# Altium schematic sheet LIM+LEDS+POWER.SchDoc: Laser PCB
size A3; DrawnBy: James Singleton; Organization: TMC Technology Ltd.; DocumentNumber: 5; Revision: A; SheetNumber: 5; SheetTotal: 18; Drawn Date: 22/12/2020
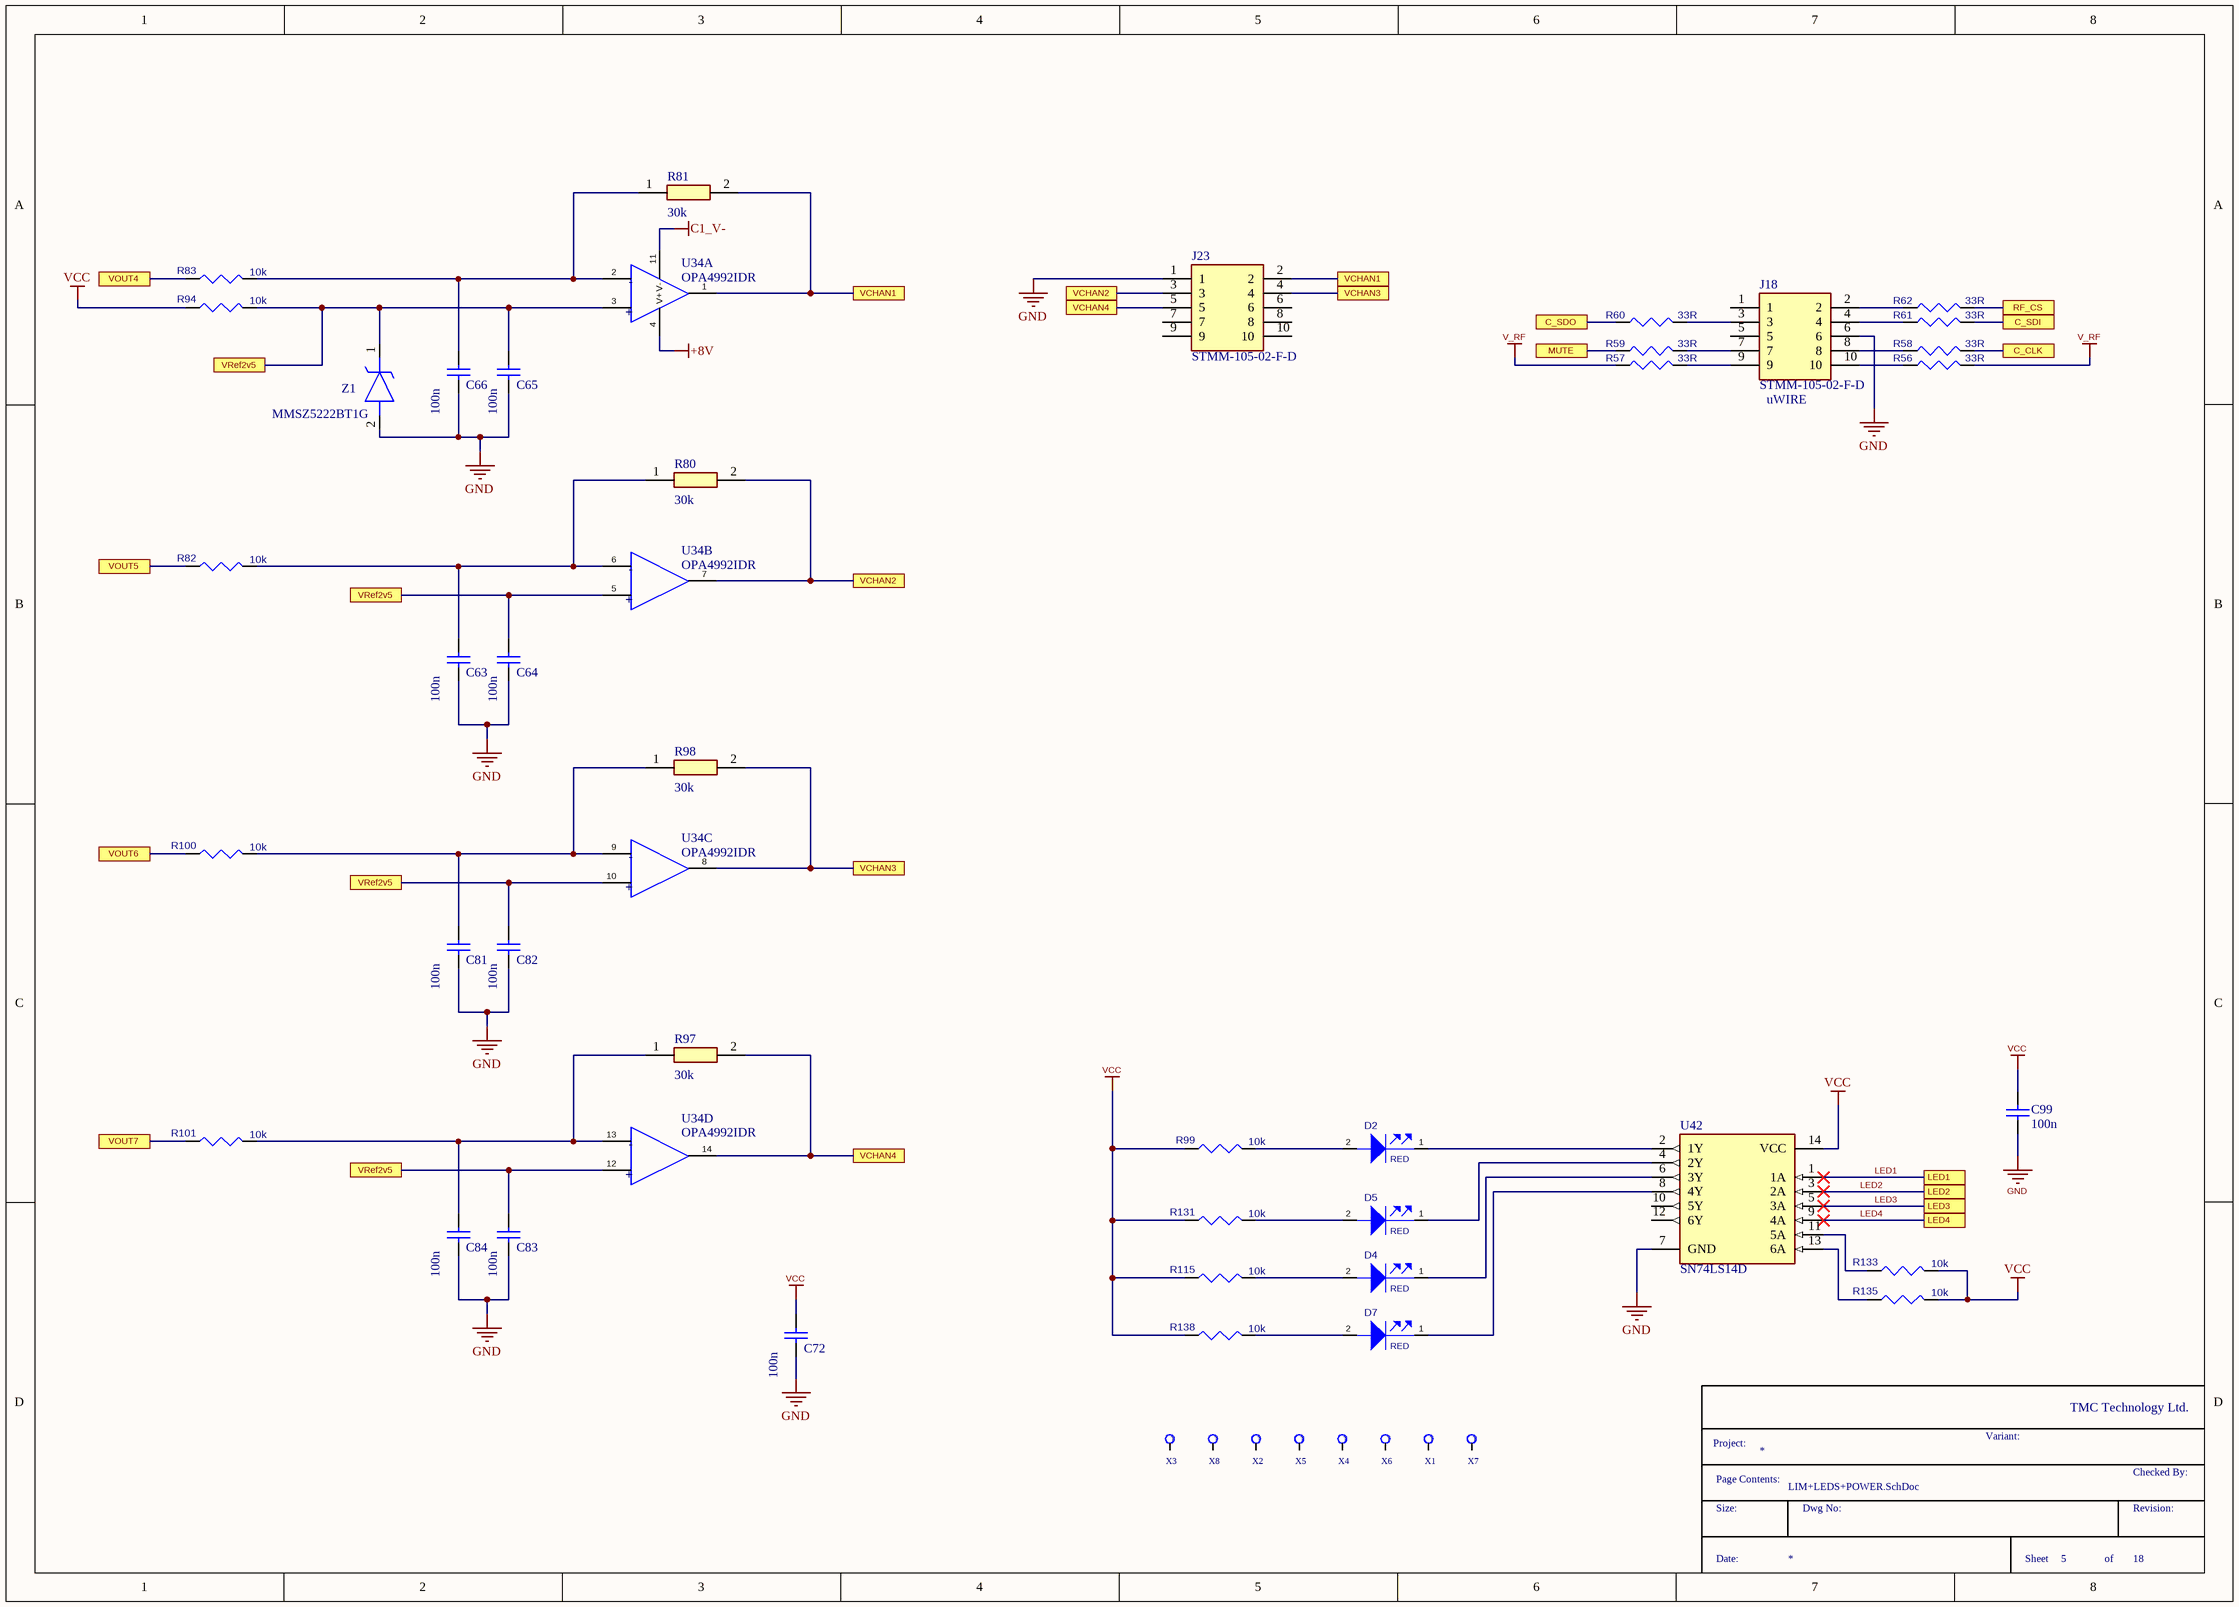
[diagram p0: LIM+LEDS+POWER.SchDoc]

## Parts
C63  100n  [CAPC1608X90X35LL15T15]
C64  100n  [CAPC1608X90X35LL15T15]
C65  100n  [CAPC1608X90X35LL15T15]
C66  100n  [CAPC1608X90X35LL15T15]
C72  100n  [CAPC1608X90X35LL15T15]
C81  100n  [CAPC1608X90X35LL15T15]
C82  100n  [CAPC1608X90X35LL15T15]
C83  100n  [CAPC1608X90X35LL15T15]
C84  100n  [CAPC1608X90X35LL15T15]
C99  100n  [CAPC1608X90X35LL15T15]
D2  value RED  [LED$2F$RA]  (hidden comment: LED)
D4  value RED  [LED$2F$RA]  (hidden comment: LED)
D5  value RED  [LED$2F$RA]  (hidden comment: LED)
D7  value RED  [LED$2F$RA]  (hidden comment: LED)
J18  STMM-105-02-F-D  value uWIRE  [STMM-105-XX-YY-D]
J23  STMM-105-02-F-D  [STMM-105-XX-YY-D]
R56  value 33R  [CR0603N]  (hidden comment: RES)
R57  value 33R  [CR0603N]  (hidden comment: RES)
R58  value 33R  [CR0603N]  (hidden comment: RES)
R59  value 33R  [CR0603N]  (hidden comment: RES)
R60  value 33R  [CR0603N]  (hidden comment: RES)
R61  value 33R  [CR0603N]  (hidden comment: RES)
R62  value 33R  [CR0603N]  (hidden comment: RES)
R80  value 30k  [ERJS03J155V]  (hidden comment: ERJ-U03F3002V)
R81  value 30k  [ERJS03J155V]  (hidden comment: ERJ-U03F3002V)
R82  value 10k  [CR0603N]  (hidden comment: RES)
R83  value 10k  [CR0603N]  (hidden comment: RES)
R94  value 10k  [CR0603N]  (hidden comment: RES)
R97  value 30k  [ERJS03J155V]  (hidden comment: ERJ-U03F3002V)
R98  value 30k  [ERJS03J155V]  (hidden comment: ERJ-U03F3002V)
R99  value 10k  [CR0603N]  (hidden comment: RES)
R100  value 10k  [CR0603N]  (hidden comment: RES)
R101  value 10k  [CR0603N]  (hidden comment: RES)
R115  value 10k  [CR0603N]  (hidden comment: RES)
R131  value 10k  [CR0603N]  (hidden comment: RES)
R133  value 10k  [CR0603N]  (hidden comment: RES)
R135  value 10k  [CR0603N]  (hidden comment: RES)
R138  value 10k  [CR0603N]  (hidden comment: RES)
U34  OPA4992IDR  [SOIC127P600X175-14N]  (parts A,B,C,D of 4)
U42  SN74LS14D  [FP-D0014A-MFG]
X1  MTG3MM  [MTG3MM]  (value not drawn)
X2  MTG3MM  [MTG3MM]  (value not drawn)
X3  MTG3MM  [MTG3MM]  (value not drawn)
X4  MTG3MM  [MTG3MM]  (value not drawn)
X5  MTG3MM  [MTG3MM]  (value not drawn)
X6  MTG3MM  [MTG3MM]  (value not drawn)
X7  MTG3MM  [MTG3MM]  (value not drawn)
X8  MTG3MM  [MTG3MM]  (value not drawn)
Z1  MMSZ5222BT1G  [SOD3716X135N]

## Ports
C_CLK (see ChipSelects+Faults[4A], ChipSelects+Faults[4B], ChipSelects+Faults[4C], ChipSelects+Faults[4D], PI_INTERFACE[1B], PI_INTERFACE[4C], PIO[3B], PIO[3D], PIO[6B], PIO[6C]), C_SDI (see ChipSelects+Faults[4D], PI_INTERFACE[1B], PI_INTERFACE[4C], PIO[3B], PIO[3D], PIO[6B], PIO[6C]), C_SDO (see PI_INTERFACE[2B], PI_INTERFACE[4C], PIO[3B], PIO[3D], PIO[6B], PIO[6C]), LED1 (see PIO[6B]), LED2 (see PIO[6C]), LED3 (see PIO[6C]), LED4 (see PIO[6C]), MUTE (see PIO[3A]), RF_CS (see ChipSelects+Faults[6C]), VCHAN1 (see LIM+LEDS+POWER[4A]), VCHAN1 (see LIM+LEDS+POWER[5A]), VCHAN2 (see LIM+LEDS+POWER[4A]), VCHAN2 (see LIM+LEDS+POWER[4B]), VCHAN3 (see LIM+LEDS+POWER[4C]), VCHAN3 (see LIM+LEDS+POWER[5A]), VCHAN4 (see LIM+LEDS+POWER[4A]), VCHAN4 (see LIM+LEDS+POWER[4C]), VOUT4 (see TEC_CONTROLLER_1[8B]), VOUT5 (see TEC_CONTROLLER_1[8B]), VOUT6 (see TEC_CONTROLLER_1[8B]), VOUT7 (see TEC_CONTROLLER_1[8B]), VRef2v5 (see LIM+LEDS+POWER[1A], LIM+LEDS+POWER[2B], LIM+LEDS+POWER[2C]), VRef2v5 (see LIM+LEDS+POWER[1A], LIM+LEDS+POWER[2C]), VRef2v5 (see LIM+LEDS+POWER[2B], LIM+LEDS+POWER[2C])

## Nets
+8V: U34.4(V+)
C1_V-: U34.11(V-)
GND: C63.2 C64.2 C65.2 C66.2 C72.2 C81.2 C82.2 C83.2 C84.2 C99.2 J18.6 J23.1 U42.7(GND) Z1.2(A)
V_RF: R56.2 R57.1
VCC: C72.1 C99.1 R94.1 R99.1 R115.1 R131.1 R133.2 R135.2 R138.1 U42.14(VCC)
C_CLK: R58.2 ; port C_CLK
C_SDI: R61.2 ; port C_SDI
C_SDO: R60.1 ; port C_SDO
LED1: U42.1(1A) ; port LED1
LED2: U42.3(2A) ; port LED2
LED3: U42.5(3A) ; port LED3
LED4: U42.9(4A) ; port LED4
MUTE: R59.1 ; port MUTE
RF_CS: R62.2 ; port RF_CS
VCHAN1: J23.2 R81.2 U34.1 ; port VCHAN1
VCHAN2: J23.3 R80.2 U34.7 ; port VCHAN2
VCHAN3: J23.4 R98.2 U34.8 ; port VCHAN3
VCHAN4: J23.5 R97.2 U34.14 ; port VCHAN4
VOUT4: R83.1 ; port VOUT4
VOUT5: R82.1 ; port VOUT5
VOUT6: R100.1 ; port VOUT6
VOUT7: R101.1 ; port VOUT7
VRef2v5: C64.1 C65.1 C82.1 C83.1 R94.2 U34.3 U34.5 U34.10 U34.12 Z1.1(K) ; port VRef2v5
NetC63_1: C63.1 R80.1 R82.2 U34.6
NetC66_1: C66.1 R81.1 R83.2 U34.2
NetC81_1: C81.1 R98.1 R100.2 U34.9
NetC84_1: C84.1 R97.1 R101.2 U34.13
NetD2_1: D2.1(CATHODE) U42.2(1Y)
NetD2_2: D2.2(ANODE) R99.2
NetD4_1: D4.1(CATHODE) U42.6(3Y)
NetD4_2: D4.2(ANODE) R115.2
NetD5_1: D5.1(CATHODE) U42.4(2Y)
NetD5_2: D5.2(ANODE) R131.2
NetD7_1: D7.1(CATHODE) U42.8(4Y)
NetD7_2: D7.2(ANODE) R138.2
NetJ18_2: J18.2 R62.1
NetJ18_3: J18.3 R60.2
NetJ18_4: J18.4 R61.1
NetJ18_7: J18.7 R59.2
NetJ18_8: J18.8 R58.1
NetJ18_9: J18.9 R57.2
NetJ18_10: J18.10 R56.1
NetR133_1: R133.1 U42.11(5A)
NetR135_1: R135.1 U42.13(6A)

Not connected (* = marked no-connect by the designer): J18 1 5; J23 6 7 8 9 10; U42 10(5Y) 12(6Y); X1 1; X2 1; X3 1; X4 1; X5 1; X6 1; X7 1; X8 1

## Notes on the sheet
- TMC Technology Ltd.
- Page Contents:
- Project:
- Variant:
- Checked By:
- Size:
- Date:
- Dwg No:
- Sheet
- of
- Revision:
- (in symbol MTG3MM) T
- (in symbol OPA4992IDR, part A) -; +
- (in symbol OPA4992IDR, part B) -; +
- (in symbol OPA4992IDR, part C) -; +
- (in symbol OPA4992IDR, part D) -; +

## Library data of the parts
C63-C66 C72 C81-C84 C99 = CMP-1035-02592-3: Chip Capacitor, 100 nF, +/- 10%, 50 V, -55 to 125 degC, 0603 (1608 Metric), RoHS, Tape and Reel; Manufacturer: KEMET; Manufacturer Part Number: C0603C104K5RACTU; Case\Package: 0603; Type (Capacitors): X7R; Capacitance: 100 nF; Voltage Rating: 50 V; Pins: 2; Max Operating Temperature: 125 degC; Min Operating Temperature: -55 degC; Case Code (Imperial): 0603; DatasheetVersion: 07/2016; Package Quantity: 4000; Length: 1.6 mm; REACH SVHC: No SVHC; Packaging: Tape and Reel; Case Code (Metric): 1608; Mounting Technology: Surface Mount; RoHSCompliant: true; Height: 0.9 mm; ComponentLink1URL: http://www.avx.com/; ComponentLink2URL: http://datasheets.avx.com/X7RDielectric.pdf; Mount: Surface Mount; ComponentLink2Description: Datasheet; Width: 0.81 mm; PackageReference: 0603; PackageDescription: 2-Pin Surface Mount Device, Body 1.6 x 0.81 mm; Radiation Hardening: No; ComponentLink1Description: Manufacturer URL; Voltage Rating (DC): 50 V; Tolerance: 10%; 8Vinv: *
D2 D4 D5 D7 = LED: LED,RED,WATERCLEAR,TH RA; Manufacturer: BROADCOM; Part No: HLMP-3301-F00B2; Source_Path: \\MIL-NS1\CIP\SCHEMATIC_SYMBOLS\LTC_DIODE.OLB; CLASS: DISCRETE; PCB DECAL: LED/RA; Order No: 1003372; Package_Type: TH RA
J18 J23 = STMM-105-02-F-D: Connector; Manufacturer_Name: SAMTEC; Datasheet Link: http://suddendocs.samtec.com/prints/stmm-1xx-xx-xx-d-xx-xx-mkt1.pdf; Manufacturer_Part_Number: STMM-105-02-F-D; Mouser Part Number: 200-STMM10502FD; Mouser Price/Stock: https://www.mouser.co.uk/ProductDetail/Samtec/STMM-105-02-F-D?qs=rU5fayqh%252BE2wrlyAPVJOww%3D%3D
R56-R62 R82 R83 R94 R99-R101 R115 R131 R133 R135 R138 = RES: RES.,10k OHMS,1%,1/10W,0603; Manufacturer_PN: ERJ3EKF1002V; Manufacturer: PANASONIC; Part No: P10.0KHCT-ND; CLASS: DISCRETE; Temperature_Coefficient: 100ppm/C; FPLIST: CR0603N,CR0603L,CR0603M; Source_Path: \\MIL-NS1\CIP\SCHEMATIC_SYMBOLS\LTC_RESISTOR.OLB; Geometry.Height: 37.40mil; PCB DECAL: CR0603N; Rated_Power: 1/10W; Tolerance: 1%; Package_Size: 0603
R80 R81 R97 R98 = ERJ-U03F3002V: Resistor; Manufacturer_Name: Panasonic; Datasheet Link: http://industrial.panasonic.com/cdbs/www-data/pdf/RDP0000/AOA0000C334.pdf; Height: 0.55mm; Manufacturer_Part_Number: ERJ-U03F3002V
U34 = OPA4992IDR: Integrated Circuit; Manufacturer_Name: Texas Instruments; Datasheet Link: https://www.ti.com/lit/ds/symlink/opa4992.pdf?ts=1675242172538&ref_url=https%253A%252F%252Fwww.ti.com%252Fproduct%252FOPA4992%252Fpart-details%252FOPA4992IDR; Height: 1.75mm; Manufacturer_Part_Number: OPA4992IDR; Mouser Part Number: 595-OPA4992IDR; Mouser Price/Stock: https://www.mouser.co.uk/ProductDetail/Texas-Instruments/OPA4992IDR?qs=doiCPypUmgFQGotnV4iSxA%3D%3D; Arrow Part Number: OPA4992IDR; Arrow Price/Stock: https://www.arrow.com/en/products/opa4992idr/texas-instruments?region=nac
U42 = CMP-1615-00144-4: IC INVERTER SCHMITT 6CH 14SOIC; Manufacturer: Texas Instruments; Propagation Delay: 15ns; Number Of Circuits: 6; Number Of Inputs: 1; Max Supply Voltage: 5.25V; Logic Function Desc: Schmitt Trigger; Max Junction Temp: +150°C; Standoff Height: 0.1mm; Min Supply Voltage: 4.75V; Lead Free: Yes; Category: IC; Height: 1.75mm; Ambient Temperature Range Low: 0°C; Octopart: https://octopart.com/sn74ls14d-texas+instruments-464458; Device Class L1: Integrated Circuits (ICs); Digikey Description: IC INVERTER SCHMITT 6CH 14SOIC; Manufacturer Part Number: SN74LS14D; Ambient Temperature Range High: +70°C; Device Class L2: Logic ICs; ComponentLink2Description: Datasheet; Device Class L3: Logic Gates; Temperature Range High: +70°C; ComponentLink2URL: http://www.ti.com/lit/ds/symlink/sn74ls14.pdf; Number Of Outputs: 1; Temperature: 0°C to +70°C; RoHS: TRUE; Mouser Description: Inverters Hex Schmitt-Trigger; Temperature Range Low: 0°C; Package: D0014A; Automotive: No
X1-X8 = MTG3MM: .128 MOUNTING HOLE / .250 PAD; Part Number: MTHOLE1; Fitted: No; Value: DNF; PCB DECAL: MTG3MM; CREATED BY: CADPRO, SAN DIEGO, CA  (619) 552-1475
Z1 = MMSZ5222BT1G: Zener Diode; Manufacturer_Name: onsemi; Datasheet Link: http://www.onsemi.com/pub/Collateral/MMSZ5221BT1-D.PDF; Height: 1.35mm; Manufacturer_Part_Number: MMSZ5222BT1G; Mouser Part Number: 863-MMSZ5222BT1G; Mouser Price/Stock: https://www.mouser.co.uk/ProductDetail/onsemi/MMSZ5222BT1G?qs=P4IOph%252Bbot8Fquvz%2FRRevw%3D%3D; Arrow Part Number: MMSZ5222BT1G; Arrow Price/Stock: https://www.arrow.com/en/products/mmsz5222bt1g/on-semiconductor?region=nac